# EAGLE design LB_o4_Vibration_Motor-v03(rev2) (EAGLE 6.6.0)
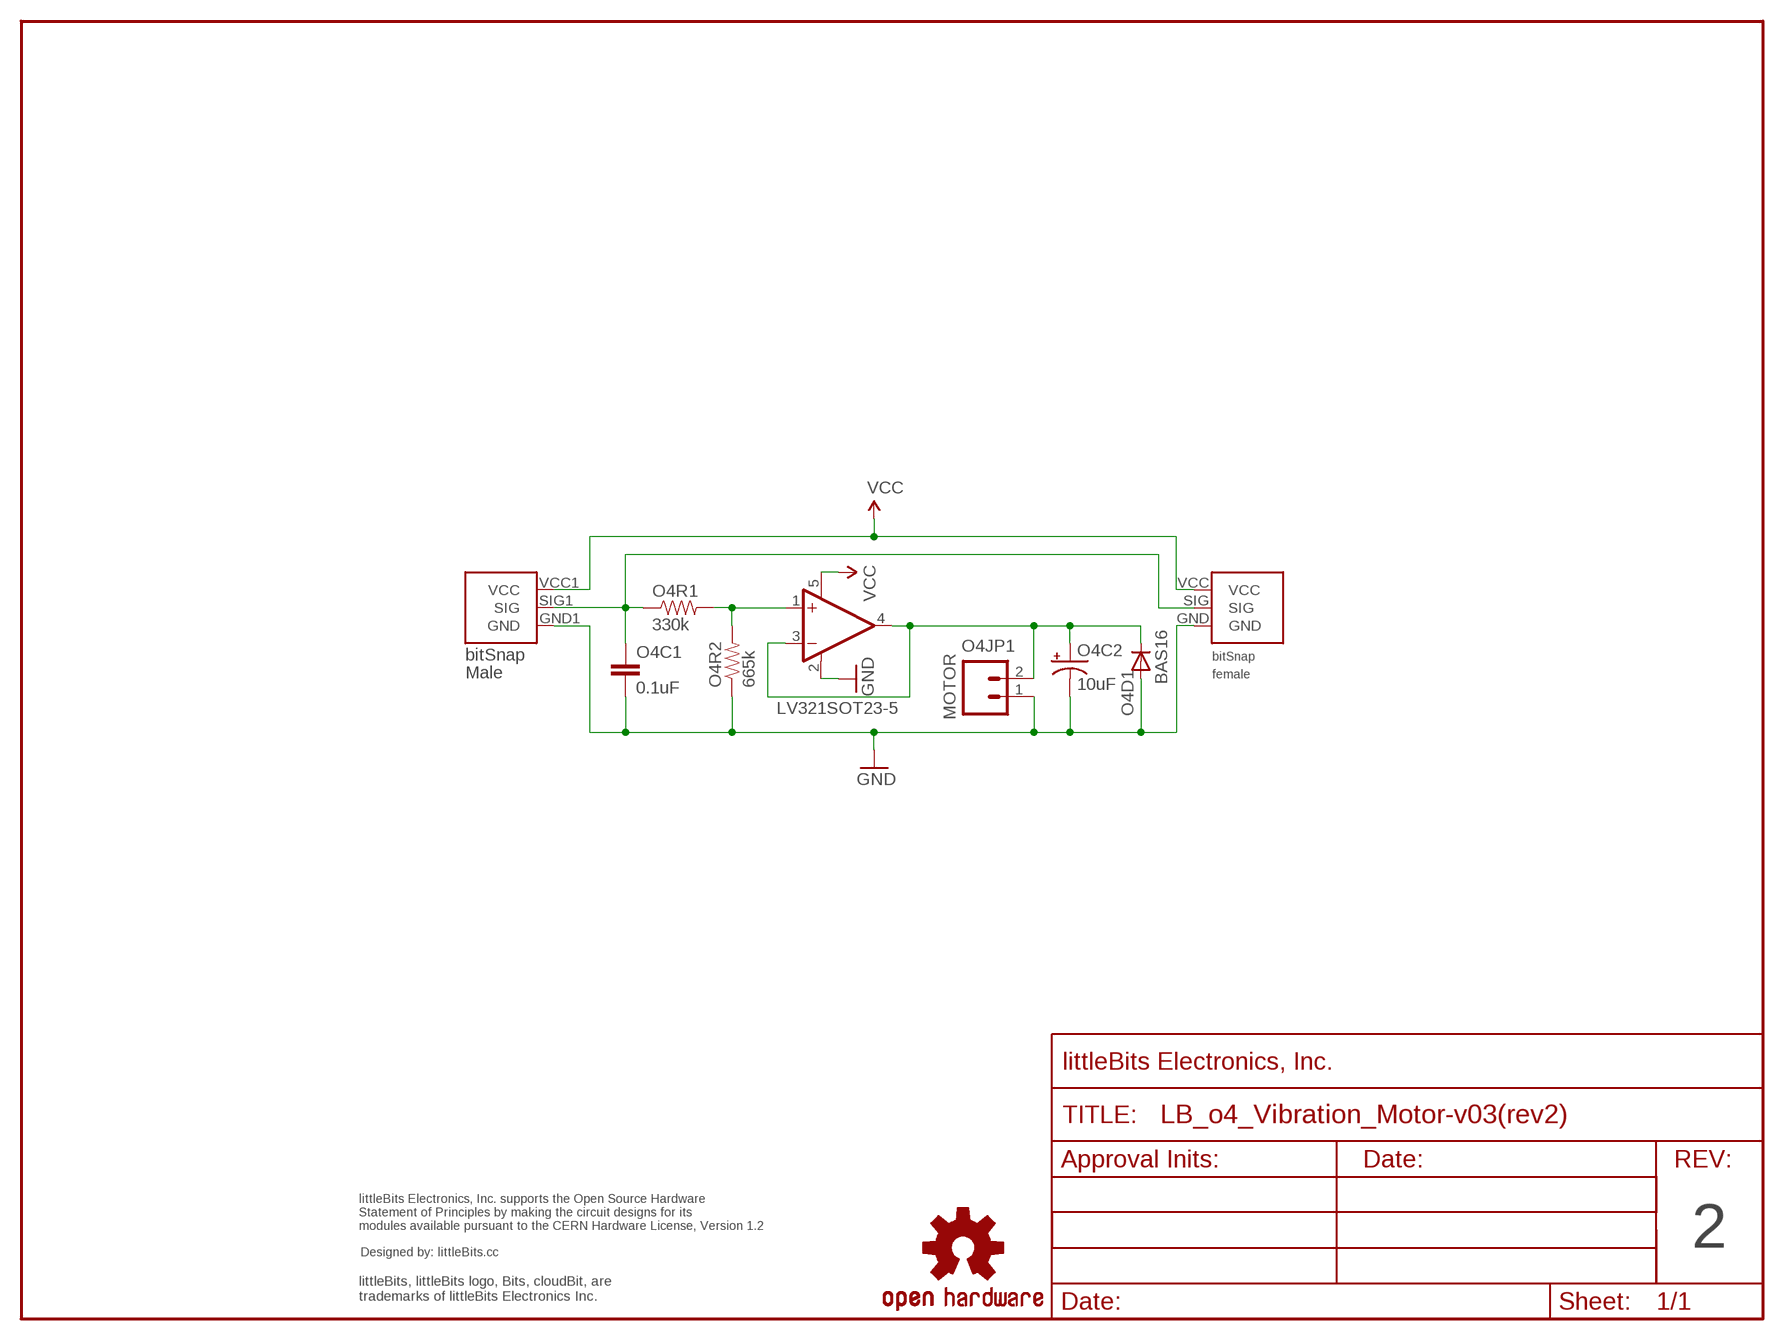
[diagram p0: schematic, sheet 1]

## Parts
O4BSF1  BITSNAP_V03_FEMALE  [BITSNAP_V03_FEMALE]
O4BSM1  BITSNAP_V03_MALE  [BITSNAP_V03_MALE]
O4C1  0.1uF  CAP0603-CAP  [0603-CAP]
O4C2  10uF  CAP_POL1206  [EIA3216]
O4D1  BAS16  DIODESOT23  [SOT23-3]
O4JP1  MOTOR  JST-MICRO-2P  [JST-MICRO_2P]
O4R1  330k  RESISTOR0603-RES  [0603-RES]
O4R2  665k  RESISTOR0603-RES  [0603-RES]
O4U1  LV321SOT23-5  [SOT23-5]
U$1  OSHWCREDIT  [OSHWCREDIT]
U$2  FRAME-LETTER-OHWOHW  [FABDWG01-OHW]
U$5  OSHW-LOGOL  [OSHW-LOGO-L]

## Nets
GND: O4BSF1.GND O4BSM1.GND1(GND) O4C1.2 O4C2.C(-) O4D1.1(A) O4JP1.1 O4R2.1 O4U1.2(V-)
N$2: O4C2.A(+) O4D1.3(C) O4JP1.2 O4U1.3(-IN) O4U1.4(OUT)
N$5: O4R1.2 O4R2.2 O4U1.1(+IN)
SIG: O4BSF1.SIG O4BSM1.SIG1(SIG) O4C1.1 O4R1.1
VCC: O4BSF1.VCC O4BSM1.VCC1(VCC) O4U1.5(V+)

## Notes on the sheet
- 2

## Library data of the parts
O4BSF1 = bitSnap:BITSNAP_V03_FEMALE
O4BSM1 = bitSnap:BITSNAP_V03_MALE
O4C1 = SparkFun:CAP: Capacitor Standard 0603 ceramic capacitor, and 0.1" leaded capacitor.
O4C2 = SparkFun:CAP_POL: Capacitor Polarized These are standard SMD and PTH capacitors. Normally 10uF, 47uF, and 100uF in electrolytic and tantalum varieties. Always verify the external diameter of the through hole cap, it varies with capacity, voltage, and manufacturer. The EIA devices should be standard.
O4D1 = SparkFun:DIODE: Diode These are standard reverse protection diodes and small signal diodes. SMA package can handle up to about 1A. SOD-323 can handle about 200mA. What the SOD-323 package when ordering, there are some mfgs out there that are 5-pin packages.
O4JP1 = LITTLEBITS:JST-MICRO-2P
O4R1 O4R2 = SparkFun:RESISTOR: Resistor Basic schematic elements and footprints for 0603, 1206, and PTH 1/10th watt (small) resistors.
O4U1 = LITTLEBITS:LV321
U$1 = LITTLEBITS:OSHWCREDIT
U$2 = LITTLEBITS:FRAME-LETTER-OHW
U$5 = LITTLEBITS:OSHW-LOGO: Open Source Hardware Logo This logo indicates the piece of hardware it is found on incorporates a OSHW license and/or adheres to the definition of open source hardware found here: http://freedomdefined.org/OSHW

## Board
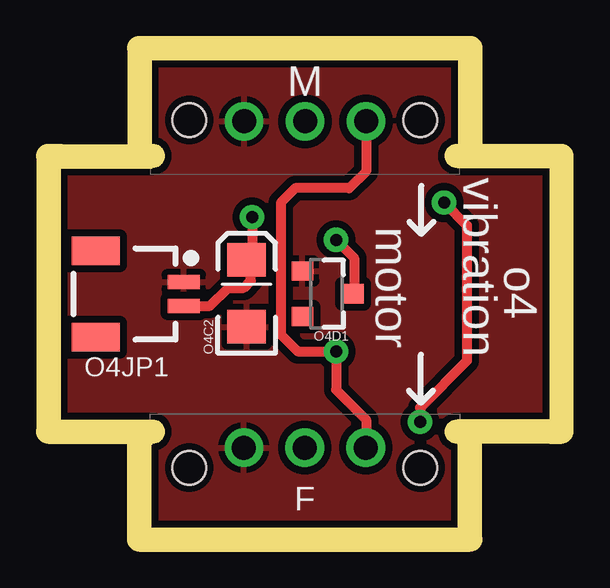
[diagram p1: board, top side]
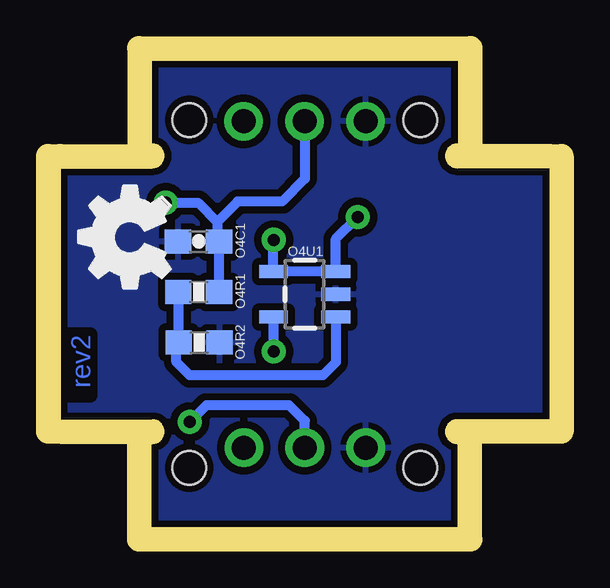
[diagram p2: board, bottom side, seen from below]

Size 20.4 x 19.5 mm. Coordinates in mm from the lower left corner, seen from the top.
Outline: 0,15 0,4.5
Outline: 20.4,15 20.4,4.5
Copper layers (1*16): Top 0.035mm / dielectric 1.5mm / Bottom 0.035mm
Design rules "default": minimum track width 8mil, minimum drill 20mil, track to track 8mil, track to pad 8mil, pad to pad 8mil, via to via 8mil, smd to smd 8mil, copper to edge 10mil, drill to drill 8mil, minimum pad ring 12mil, minimum via ring 10mil, stop-mask expansion 4mil, vias tented up to drill 25mil, thermal gap 10mil
Milling: 6 lines

### Footprints (pad centres in the part's own frame; a part is rotated, then mirrored left to right if it is on the bottom)
BITSNAP_V03_FEMALE = drill 1: GND 3.91,3.33; SIG 6.45,3.33; VCC 8.99,3.33 | hole 1.4: 1.63,2.5; 11.27,2.5
BITSNAP_V03_MALE = drill 1: GND1 8.98,2.56; SIG1 6.44,2.56; VCC1 3.9,2.56 | hole 1.4: 11.27,2.5; 1.63,2.5
0603-CAP = smd 1.1 x 1: 1 -0.85,0; 2 0.85,0
EIA3216 = smd 1.4 x 1.6: A 1.4,0; C -1.4,0
SOT23-3 = smd 0.8 x 0.9: 1 -0.95,-1; 2 0.95,-1; 3 0,1.1
JST-MICRO_2P = smd 0.6 x 1.35: 1 -0.51,2.66; 2 0.49,2.66 | smd 1.2 x 2: NC1 1.79,-1.015; NC2 -1.81,-1.015
0603-RES = smd 1.1 x 1: 1 -0.85,0; 2 0.85,0
SOT23-5 = smd 0.55 x 1.2: 1 -0.95,-1.3; 2 0,-1.3; 3 0.95,-1.3; 4 0.95,1.3; 5 -0.95,1.3

### Placement (x,y rotation side)
O4BSF1  3.75,0 0 top
O4BSM1  16.65,19.5 180 top
O4C1  14.63,11.93 180 bottom
O4C2  7.77,9.77 90 top
O4D1  11.1,9.75 270 top
O4JP1  2.5,9.73 270 top
O4R1  14.62,9.83 180 bottom
O4R2  14.6,7.72 180 bottom
O4U1  10.21,9.73 90 bottom
U$1  -89.85,-62.55 0 top  (outside the outline)
U$2  0.15,0.15 0 top
U$4  [OSHW_FILLX150_NOTEXT]  15.81,9.16 0 top
U$5  -29.79,-68.64 0 top  (outside the outline)

### Tracks (layer width: path | path; a pad name or v marks a point on that pad's centre or on a via)
GND
  pour Bottom (isolate 0.305): 0.15,19.37 0.15,0.15 20.27,0.15 20.27,19.37
  pour Top (isolate 0.305): 0.15,19.37 0.15,0.15 20.27,0.15 20.27,19.37
N$2  (via drill 0.5)
  Top 0.406: O4JP1.2 6.24,9.24 7,10 7.65,10 7.95,10.3 7.95,11.15 O4C2.A 8,11.2 v8,12.95 | v11.5,12 12.25,11.25 12.25,9.8 O4D1.3
  Bottom 0.406: v8,12.95 8.91,12.05 O4U1.3 O4U1.4 v11.51,11.99 v11.5,12
N$5
  Bottom 0.406: O4U1.1 8.91,6.89 9.45,6.35 15,6.35 15.55,6.9 15.55,7.72 O4R2.2 15.45,9.81 O4R1.2
SIG  (via drill 0.5)
  Top 0.406: v16,13.55 16.95,12.6 16.95,6.95 15,5 v15,4.4
  Bottom 0.406: O4BSF1.SIG 10.2,4.45 10.85,5.1 14.3,5.1 v15,4.4 | v16,13.55 14.65,13.55 13.85,12.75 | 13.85,12.75 13.85,11.96 O4C1.1 O4R1.1 | O4BSM1.SIG1 10.2,14.55 11.15,13.6 13,13.6 13.85,12.75
VCC  (via drill 0.5)
  Top 0.406: O4BSF1.VCC 12.75,4.5 11.5,5.75 v11.5,7.35 9.9,7.35 9.2,8.05 9.2,13.55 9.8,14.15 12.05,14.15 12.75,14.85 O4BSM1.VCC1
  Bottom 0.406: O4U1.5 v11.51,7.36 v11.5,7.35

### Text on the board
Bottom: rev2
tPlace: vibration | motor | o4
Milling: 1mm DIA. ROUTER PATH
dxf: 2 | o4 VIBRATION MOTOR BIT PCB | LB-BIT-o4-VIBRATIONMOTOR-v03-GERBER-rev2 (8-31-2012)